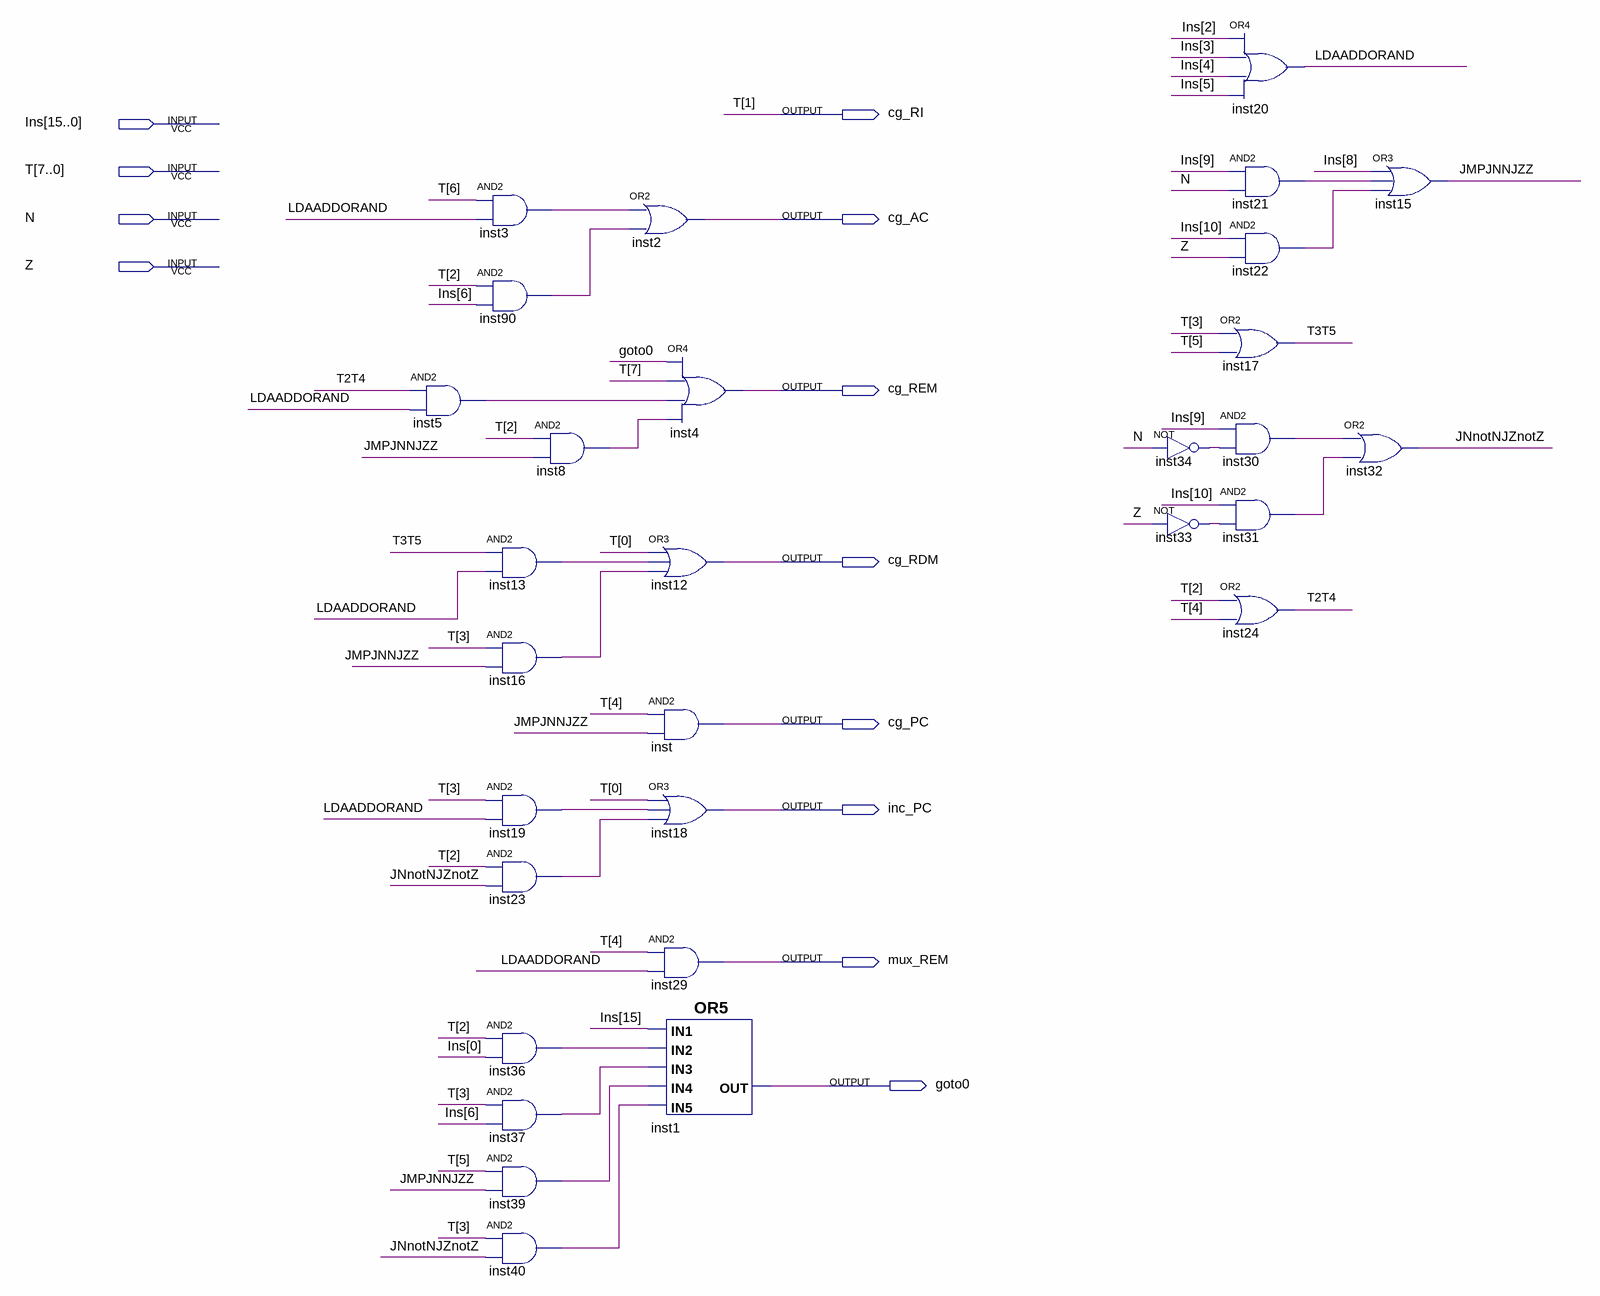
[diagram p0: schematic sheet]
// Quartus schematic EQUATIONS.bdf as structural Verilog: 30 symbols, 12 pins
module EQUATIONS (
  input  [15:0] Ins,
  input  [7:0] T,
  input  N,
  input  Z,
  output cg_RI,
  output cg_AC,
  output cg_REM,
  output cg_RDM,
  output cg_PC,
  output inc_PC,
  output mux_REM,
  output goto0
);

  wire inst3_out, inst5_out, inst8_out, inst13_out, inst16_out, inst19_out, inst21_out, inst22_out,
       inst23_out, inst30_out, inst31_out, inst33_out, inst34_out, inst36_out, inst37_out, inst39_out,
       inst40_out, inst90_out, JMPJNNJZZ, JNnotNJZnotZ, LDAADDORAND, T2T4, T3T5;

  and inst5 (inst5_out, T2T4, LDAADDORAND);
  and inst3 (inst3_out, T[6], LDAADDORAND);
  and inst90 (inst90_out, T[2], Ins[6]);
  and inst13 (inst13_out, T3T5, LDAADDORAND);
  and inst16 (inst16_out, T[3], JMPJNNJZZ);
  and inst19 (inst19_out, T[3], LDAADDORAND);
  and inst23 (inst23_out, T[2], JNnotNJZnotZ);
  and inst36 (inst36_out, T[2], Ins[0]);
  and inst37 (inst37_out, T[3], Ins[6]);
  and inst39 (inst39_out, T[5], JMPJNNJZZ);
  and inst40 (inst40_out, T[3], JNnotNJZnotZ);
  and inst8 (inst8_out, T[2], JMPJNNJZZ);
  or inst2 (cg_AC, inst3_out, inst90_out);
  or inst12 (cg_RDM, T[0], inst13_out, inst16_out);
  and inst (cg_PC, T[4], JMPJNNJZZ);
  or inst18 (inc_PC, T[0], inst19_out, inst23_out);
  and inst29 (mux_REM, T[4], LDAADDORAND);
  or inst1 (goto0, Ins[15], inst36_out, inst37_out, inst39_out, inst40_out);
  or inst4 (cg_REM, goto0, T[7], inst5_out, inst8_out);
  not inst34 (inst34_out, N);
  not inst33 (inst33_out, Z);
  or inst20 (LDAADDORAND, Ins[2], Ins[3], Ins[4], Ins[5]);
  and inst21 (inst21_out, Ins[9], N);
  and inst22 (inst22_out, Ins[10], Z);
  or inst17 (T3T5, T[3], T[5]);
  and inst30 (inst30_out, Ins[9], inst34_out);
  and inst31 (inst31_out, Ins[10], inst33_out);
  or inst24 (T2T4, T[2], T[4]);
  or inst32 (JNnotNJZnotZ, inst30_out, inst31_out);
  or inst15 (JMPJNNJZZ, Ins[8], inst21_out, inst22_out);

  assign cg_RI = T[1];
endmodule
